# Altium schematic sheet 719FLY底板原理图.SchDoc
size A4; SheetNumber: 1; SheetTotal: 1
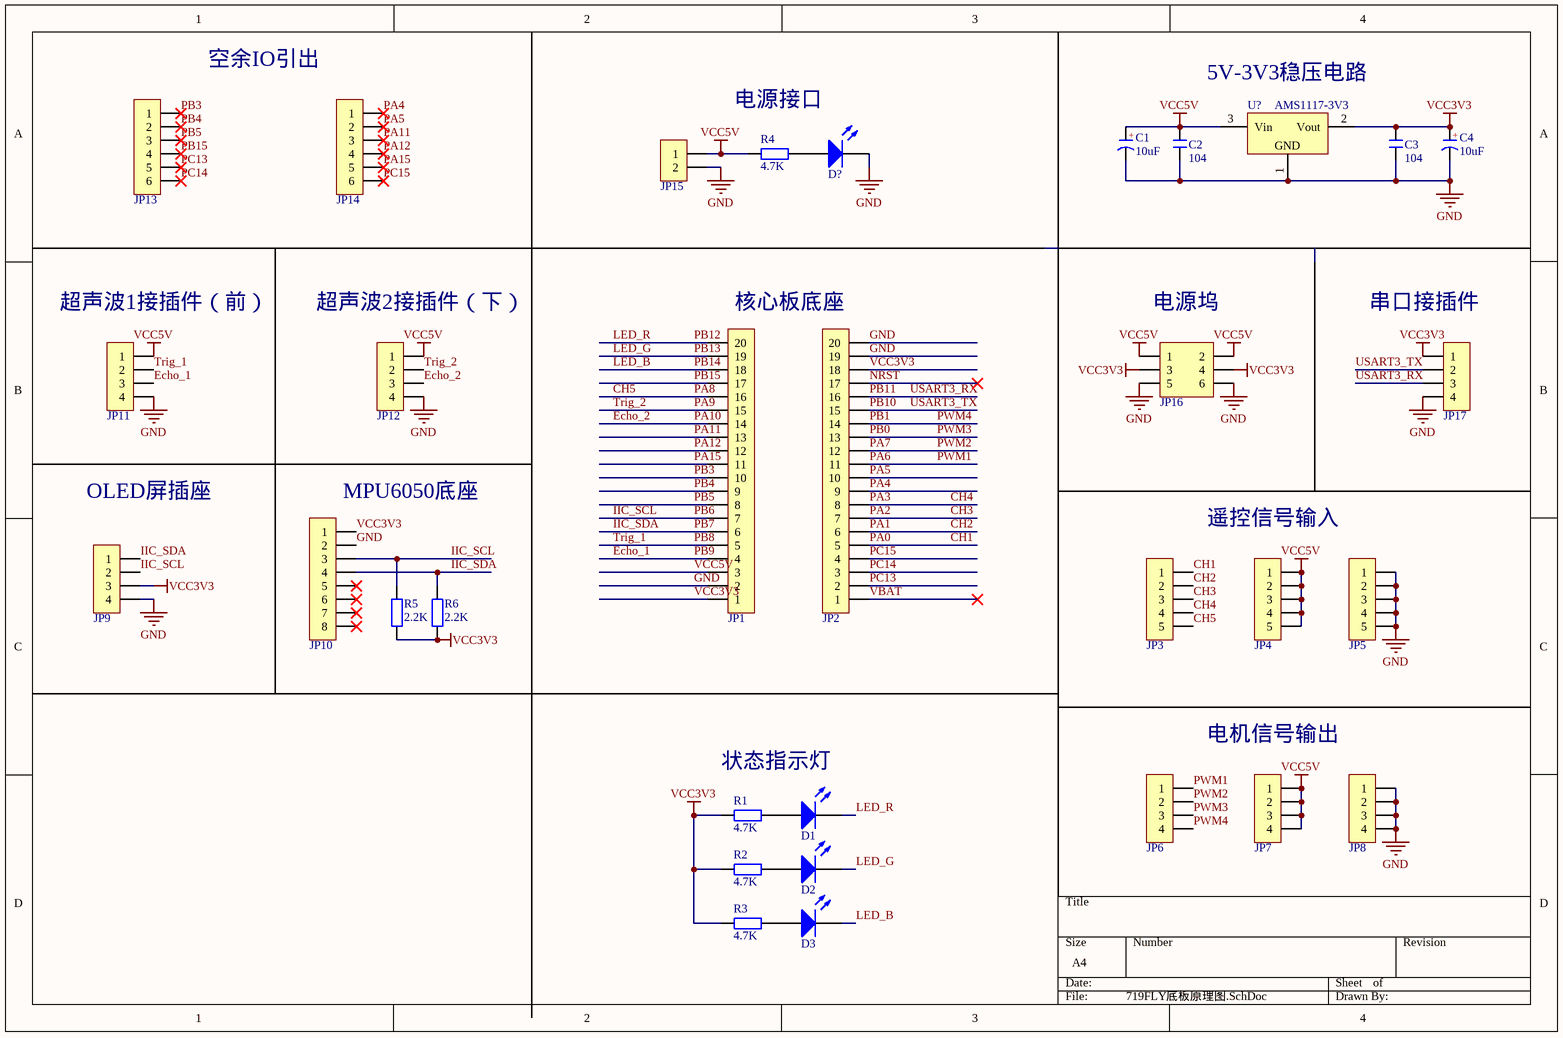
[diagram p0: 719FLY底板原理图.SchDoc]

## Parts
C1  10uF  [CAP 2.0*5*11]
C2  104  [C 0805_L]
C3  104  [C 0805_L]
C4  10uF  [CAP 2.0*5*11]
D1  LED  [LED 0805R]  (value not drawn)
D2  LED  [LED 0805G]  (value not drawn)
D3  LED  [LED 0805B]  (value not drawn)
D?  LED  [LED 0805W]  (value not drawn)
JP1  HDR-1X20  [HDR2.54-M-LI-20P]  (value not drawn)
JP2  HDR-1X20  [HDR2.54-M-LI-20P]  (value not drawn)
JP3  HDR-1X5  [HDR2.54-LI-5P]  (value not drawn)
JP4  HDR-1X5  [HDR2.54-LI-5P]  (value not drawn)
JP5  HDR-1X5  [HDR2.54-LI-5P]  (value not drawn)
JP6  HDR-1X4  [HDR2.54-LI-4P]  (value not drawn)
JP7  HDR-1X4  [HDR2.54-LI-4P]  (value not drawn)
JP8  HDR-1X4  [HDR2.54-LI-4P]  (value not drawn)
JP9  HDR-1X4  [HDR2.54-M-LI-4P]  (value not drawn)
JP10  HDR-1X8  [HDR2.54-LI-8P]  (value not drawn)
JP11  HDR-1X4  [HDR2.54-M-LI-4P]  (value not drawn)
JP12  HDR-1X4  [HDR2.54-M-LI-4P]  (value not drawn)
JP13  HDR-1X6  [HDR2.54-LI-6P]  (value not drawn)
JP14  HDR-1X6  [HDR2.54-LI-6P]  (value not drawn)
JP15  HDR-1X2  [XH2.54-LI-2P]  (value not drawn)
JP16  Header3X2  [HDR2.54-LI-2x3P]  (value not drawn)
JP17  HDR-1X4  [HDR2.54-LI-4P]  (value not drawn)
R1  4.7K  [R 0805_L]
R2  4.7K  [R 0805_L]
R3  4.7K  [R 0805_L]
R4  4.7K  [R 0805_L]
R5  2.2K  [R 0805_L]
R6  2.2K  [R 0805_L]
U?  AMS1117-3V3  [SOT223_N]

## Nets
GND: C1.2(K) C2.1 C3.1 C4.2(K) D?.2(K) JP1.2 JP2.19 JP2.20 JP5.1 JP5.2 JP5.3 JP5.4 JP5.5 JP8.1 JP8.2 JP8.3 JP8.4 JP9.4 JP10.2 JP11.4 JP12.4 JP15.2 JP16.5 JP16.6 JP17.4 U?.1(GND)
VCC3V3: C3.2 C4.1(A) JP1.1 JP2.18 JP9.3 JP10.1 JP16.3 JP16.4 JP17.1 R1.1 R2.1 R3.1 R5.2 R6.1 U?.2(Vout)
VCC5V: C1.1(A) C2.2 JP1.3 JP4.1 JP4.2 JP4.3 JP4.4 JP4.5 JP7.1 JP7.2 JP7.3 JP7.4 JP11.1 JP12.1 JP15.1 JP16.1 JP16.2 R4.1 U?.3(Vin)
CH1: JP2.5 JP3.1  [also labelled PA0]
CH2: JP2.6 JP3.2  [also labelled PA1]
CH3: JP2.7 JP3.3  [also labelled PA2]
CH4: JP2.8 JP3.4  [also labelled PA3]
CH5: JP1.16 JP3.5  [also labelled PA8]
Echo_1: JP1.4 JP11.3  [also labelled PB9]
Echo_2: JP1.14 JP12.3  [also labelled PA10]
IIC_SCL: JP1.7 JP9.2 JP10.3 R5.1  [also labelled PB6]
IIC_SDA: JP1.6 JP9.1 JP10.4 R6.2  [also labelled PB7]
LED_B: D3.2(K) JP1.18  [also labelled PB14]
LED_G: D2.2(K) JP1.19  [also labelled PB13]
LED_R: D1.2(K) JP1.20  [also labelled PB12]
NRST: JP2.17
PA4: JP2.9 JP14.1
PA5: JP2.10 JP14.2
PA6: JP2.11 JP6.1  [also labelled PWM1]
PA7: JP2.12 JP6.2  [also labelled PWM2]
PA9: JP1.15 JP12.2  [also labelled Trig_2]
PA11: JP1.13 JP14.3
PA12: JP1.12 JP14.4
PA15: JP1.11 JP14.5
PB0: JP2.13 JP6.3  [also labelled PWM3]
PB1: JP2.14 JP6.4  [also labelled PWM4]
PB3: JP1.10 JP13.1
PB4: JP1.9 JP13.2
PB5: JP1.8 JP13.3
PB8: JP1.5 JP11.2  [also labelled Trig_1]
PB10: JP2.15 JP17.2  [also labelled USART3_TX]
PB11: JP2.16 JP17.3  [also labelled USART3_RX]
PB15: JP1.17 JP13.4
PC13: JP2.2 JP13.5
PC14: JP2.3 JP13.6
PC15: JP2.4 JP14.6
VBAT: JP2.1
NetD1_1: D1.1(A) R1.2
NetD2_1: D2.1(A) R2.2
NetD3_1: D3.1(A) R3.2
NetD?_1: D?.1(A) R4.2

Not connected (* = marked no-connect by the designer): JP10 5* 6* 7* 8*

## Notes on the sheet
- 空余IO引出
- 电源接口
- 5V-3V3稳压电路
- (near JP11) 超声波1接插件（前）
- (near JP12) 超声波2接插件（下）
- (near JP1) 核心板底座
- (near JP16) 电源坞
- (near JP17) 串口接插件
- OLED屏插座
- (near JP10) MPU6050底座
- 遥控信号输入
- 状态指示灯
- 电机信号输出
- (in symbol C-CAP) +

## Library data of the parts
C1 C4 = C-CAP: 直插电解电容; 版权归属: 源创客; BOM名称: 直插电解电容; 学习资源: www.ooocke.com
C2 C3 = C: 无极性贴片电容; 版权归属: 源创客; 材质: X7R; BOM名称: 无极性贴片电容; 学习资源: www.ooocke.com
D1-D3 D? = LED: 发光二极管; 技术支持，联系售后: https://shop463601444.taobao.com
JP1 JP2 = Header 20: 20P接插件; 版权归属: 封装库来自淘宝 ID：黄晶宝石; BOM名称: 20P接插件; 学习资源: https://shop463601444.taobao.com
JP3-JP5 = Header 5: 5P接插件; 版权归属: 封装库来自淘宝 ID：黄晶宝石; BOM名称: 5P接插件; 学习资源: https://shop463601444.taobao.com
JP6-JP8 = Header 4: 4P接插件; 版权归属: 封装库来自淘宝 ID：黄晶宝石; BOM名称: 4P接插件; 学习资源: https://shop463601444.taobao.com
JP9 JP11 JP12 JP17 = Header 4: 4P接插件; 版权归属: 源创客; BOM名称: 4P接插件; 学习资源: www.ooocke.com
JP10 = Header 8: 8P接插件; 版权归属: 封装库来自淘宝 ID：黄晶宝石; BOM名称: 8P接插件; 学习资源: https://shop463601444.taobao.com
JP13 JP14 = Header 6: 6P接插件; 版权归属: 封装库来自淘宝 ID：黄晶宝石; BOM名称: 6P接插件; 学习资源: https://shop463601444.taobao.com
JP15 = Header 2: 2P接插件; 版权归属: 源创客; BOM名称: 2P接插件; 学习资源: www.ooocke.com
JP16 = Header 3X2: 3*2P接插件; 版权归属: 封装库来自淘宝 ID：黄晶宝石; BOM名称: 3*2P接插件; 学习资源: https://shop463601444.taobao.com
R1-R6 = 1R: 贴片电阻; 版权归属: 源创客; BOM名称: 贴片电阻; 学习资源: www.ooocke.com
U? = AMS1117: 三端稳压芯片; BOM名称: 稳压芯片; 版权归属: 源创客; 学习资源: www.ooocke.com